# Altium schematic sheet DMP_SEM_ETHERNET.SchDoc: Target MCU
size A3; Organization: Microchip; Address1: Vestre Rosten 79; Address2: N-7075 TILLER; Address3: NORWAY; DocumentNumber: A09-2748; Revision: 11; SheetNumber: 3; SheetTotal: 4; DrawnBy: Microchip Norway; Engineer: HN; PageSetup: Record=PageOptions|CenterHorizontal=True|CenterVertical=True|PrintScale=1.01|XCorrection=1.00|YCorrection=1.00|PrintKind=1|BorderSize=5000000|LeftOffset=0|BottomOffset=0|Orientation=2|PaperLength=1000|PaperWidth=1000|Scale=100|PaperSource=7|PrintQuality=-4|MediaType=1|DitherType=10|PaperKind=A3 (297 x 420 mm)|PrintScaleMode=1; ProjectTitle: SAM E54 Xplained Pro; PCBNumber: A08-2643; PCBRevision: 4; ProjectName: SAM E54 Xplained Pro
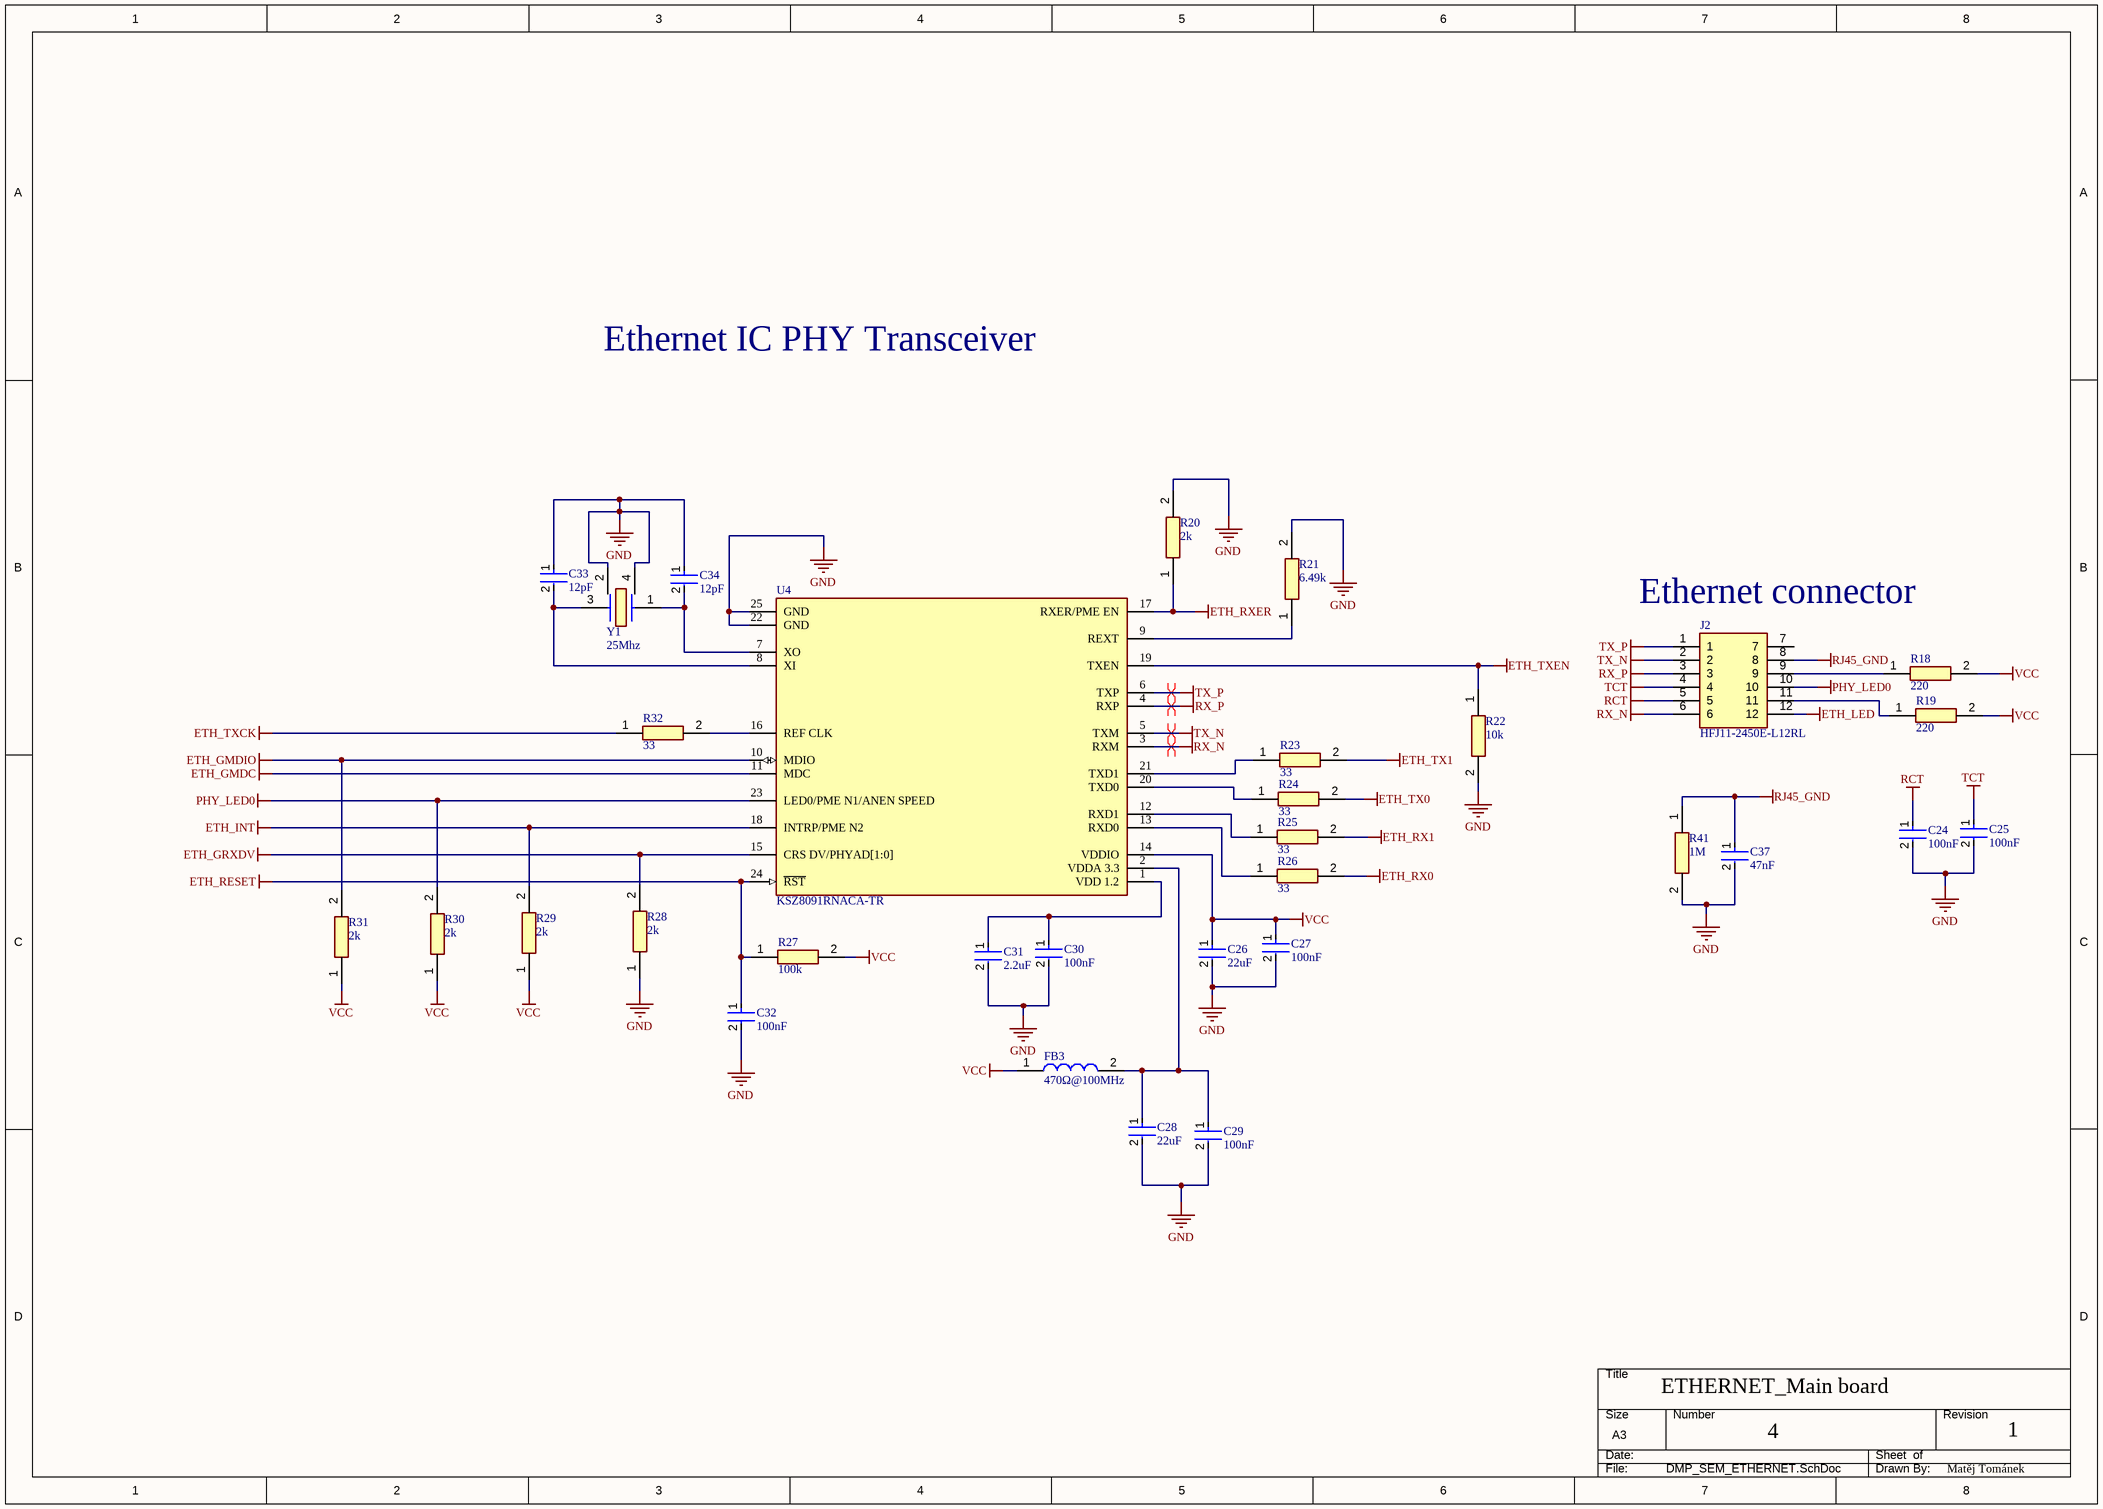
[diagram p0: DMP_SEM_ETHERNET.SchDoc]

## Parts
C24  100nF  [CL05B104KO5NNNC]
C25  100nF  [CL05B104KO5NNNC]
C26  22uF  [GRM188R61A226ME15D]
C27  100nF  [CL05B104KO5NNNC]
C28  22uF  [GRM188R61A226ME15D]
C29  100nF  [CL05B104KO5NNNC]
C30  100nF  [CL05B104KO5NNNC]
C31  2.2uF  [GRM188R61C225KAADJ]
C32  100nF  [CL05B104KO5NNNC]
C33  12pF  [C0402C120J5GACTU]
C34  12pF  [C0402C120J5GACTU]
C37  47nF  [C0603X473J3RAC3316]
FB3  470Ω@100MHz  [BLM18PG471SN1D]
J2  HFJ11-2450E-L12RL  [HFJ11-2450E-L12RL]
R18  220  [CRCW0603220RFKEC]
R19  220  [CRCW0603220RFKEC]
R20  2k  [ERA-2AEB202X]
R21  6.49k  [ERA-3AEB6491V]
R22  10k  [CRCW060310K0FKEA]
R23  33  [ERJ-U02F33R0X]
R24  33  [ERJ-U02F33R0X]
R25  33  [ERJ-U02F33R0X]
R26  33  [ERJ-U02F33R0X]
R27  100k  [ERJ-2RKF1003X]
R28  2k  [ERA-2AEB202X]
R29  2k  [ERA-2AEB202X]
R30  2k  [ERA-2AEB202X]
R31  2k  [ERA-2AEB202X]
R32  33  [ERJ-U02F33R0X]
R41  1M  [RC0402FR-071ML]
U4  KSZ8091RNACA-TR  [KSZ8091RNACA-TR]
Y1  25Mhz  [LFXTAL071758Cutt]

## Nets
ETH_GMDC: U4.11(MDC)
ETH_GMDIO: R31.2 U4.10(MDIO)
ETH_GRXDV: R28.2 U4.15(CRS_DV/PHYAD[1:0])
ETH_INT: R29.2 U4.18(INTRP/PME_N2)
ETH_LED: J2.12
ETH_RESET: C32.1 R27.1 U4.24(~{RST})
ETH_RX0: R26.2
ETH_RX1: R25.2
ETH_RXER: R20.1 U4.17(RXER/PME_EN)
ETH_TX0: R24.2
ETH_TX1: R23.2
ETH_TXCK: R32.1
ETH_TXEN: R22.1 U4.19(TXEN)
GND: C24.2 C25.2 C26.2 C27.2 C28.2 C29.2 C30.2 C31.2 C32.2 C33.1 C34.1 C37.2 R20.2 R21.2 R22.2 R28.1 R41.2 U4.22(GND) U4.25(GND) Y1.2 Y1.4
PHY_LED0: J2.10 R30.2 U4.23(LED0/PME_N1/ANEN_SPEED)
RCT: C24.1 J2.5
RJ45_GND: C37.1 J2.8 R41.1
RX_N: J2.6 U4.3(RXM)
RX_P: J2.3 U4.4(RXP)
TCT: C25.1 J2.4
TX_N: J2.2 U4.5(TXM)
TX_P: J2.1 U4.6(TXP)
VCC: C26.1 C27.1 FB3.1 R18.2 R19.2 R27.2 R29.1 R30.1 R31.1 U4.14(VDDIO)
NetC28_1: C28.1 C29.1 FB3.2 U4.2(VDDA_3.3)
NetC30_1: C30.1 C31.1 U4.1(VDD_1.2)
NetC33_2: C33.2 U4.8(XI) Y1.3
NetC34_2: C34.2 U4.7(XO) Y1.1
NetJ2_9: J2.9 R18.1
NetJ2_11: J2.11 R19.1
NetR21_1: R21.1 U4.9(REXT)
NetR23_1: R23.1 U4.21(TXD1)
NetR24_1: R24.1 U4.20(TXD0)
NetR25_1: R25.1 U4.12(RXD1)
NetR26_1: R26.1 U4.13(RXD0)
NetR32_2: R32.2 U4.16(REF_CLK)

Not connected (* = marked no-connect by the designer): J2 7

## Layout directives
differential pair: RX_N, RX_P, TX_N, TX_P

## Notes on the sheet
- Ethernet IC PHY Transceiver
- (near J2) Ethernet connector
- ETHERNET_Main board
- 4
- 1
- Matěj Tománek
- DWG. NO.
- REV.
- SHT.
- THIS DOCUMENT AND THE DATA DISCLOSED HEREIN OR HEREWITH IS THE PROPERTY OF ALTIUM LIMITED AND MAY BE FREELY DISTRIBUTED IN WHOLE. NO RIGHTS ARE RESERVED OR EXPRESS OR IMPLIED WARANTEE GIVEN.
- REVISION
- DESCRIPTION
- DATE
- APPROVED
- ENG:
- APPROVALS
- PROJECT
- DSN:
- CHK:
- REFERENCE DOCUMENTS
- PROJECT REVISION:
- TITLE
- DOCUMENT REVISION:
- DESIGN ITEM:
- BOM:
- FAB DWG:
- PCB DWG:
- ASSY DWG:
- SCALE:
- SIZE
- B
- CAGE CODE
- FILE NAME
- DWG NO.
- SHEET
- OF
- REV

## Library data of the parts
C24 C25 C27 C29 C30 C32 = CL05B104KO5NNNC: Capacitor CL05B104KO5NNNC
C26 C28 = GRM188R61A226ME15D: Capacitor GRM188R61A226ME15D
C31 = GRM188R61C225KAADJ: Capacitor GRM188R61C225KAADJ
C33 C34 = C0402C120J5GACTU: CAP CER 12PF 50V C0G/NP0 0402 C0402C120J5GACTU
C37 = C0603X473J3RAC3316: Capacitor C0603X473J3RAC3316
FB3 = BLM18PG471SN1D: Chip Ferrite Bead, 0603, 470Ω @ 100MHz, 0.2Ω, 25%, 1A BLM18PG471SN1D
J2 = HFJ11-2450E-L12RL: RJ-45 Connector
R18 R19 = CRCW0603220RFKEC: Resistor CRCW0603220RFKEC
R20 R28-R31 = ERA-2AEB202X: Resistor
R21 = ERA-3AEB6491V: Resistor ERA-3AEB6491V
R22 = CRCW060310K0FKEA: Resistor CRCW060310K0FKEA
R23-R26 R32 = ERJ-U02F33R0X: Resistor
R27 = ERJ-2RKF1003X: Resistor
R41 = RC0402FR-071ML: Resistor RC0402FR-071ML
U4 = KSZ8091RNACA-TR: IC TRANSCIEVER
Y1 = LFXTAL071758Cutt: Crystal LFXTAL071758Cutt